# Altium schematic sheet Analog.SchDoc: Analog
size A4; Author: -; CompanyName: IOElectro; DrawnBy: Esmaeill M; Engineer: -; Organization: IOElectro; Address1: Bushehr,Iran; Address2: www.ioelectro.ir; DocumentNumber: 5; Revision: v0.1; SheetNumber: 5; SheetTotal: 6; ProjectNumber: 1013; Note: Analog module
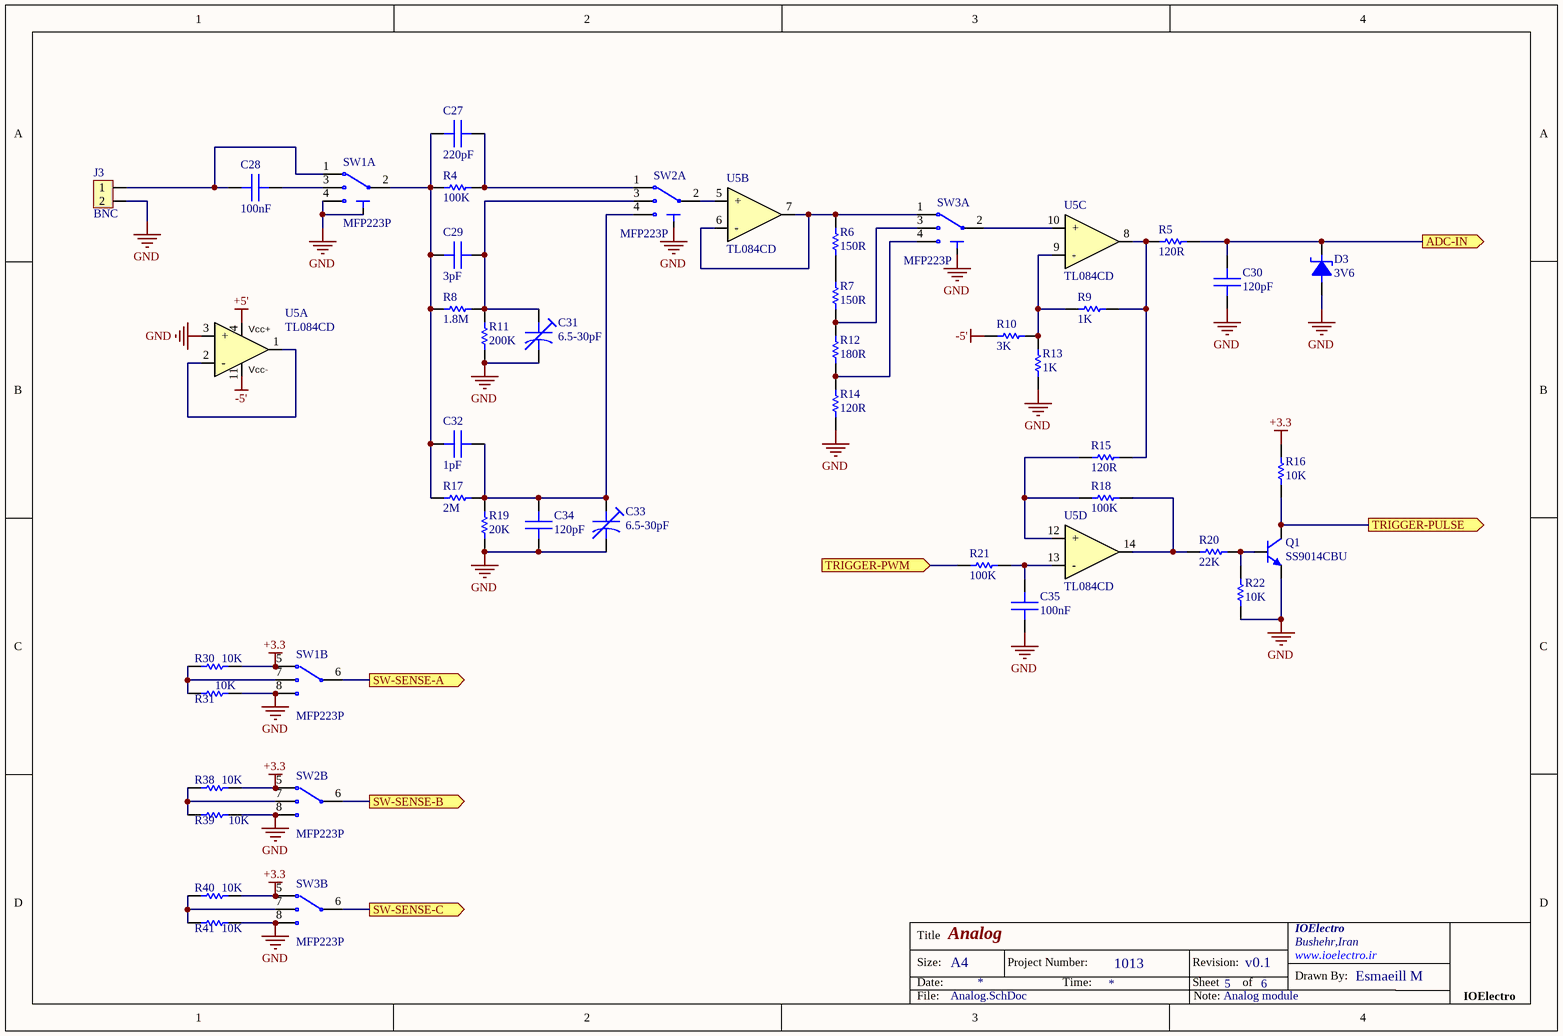
[diagram p0: Analog.SchDoc]

## Parts
C27  220pF  [C-BP-Ceramic-DIP]
C28  100nF  [C-BP-Ceramic-DIP]
C29  3pF  [C-BP-Ceramic-DIP]
C30  120pF  [C-BP-Ceramic-DIP]
C31  6.5-30pF  [C-TR-DIP_5mm]
C32  1pF  [C-BP-Ceramic-DIP]
C33  6.5-30pF  [C-TR-DIP_5mm]
C34  120pF  [C-BP-Ceramic-DIP]
C35  100nF  [C-BP-Ceramic-DIP]
D3  3V6  [SOD80]
J3  BNC  [PH-1X2-N3D]
Q1  SS9014CBU  [TO-92]
R4  100K  [R-1/4W-DIP-Blue]
R5  120R  [R-1/4W-DIP-Blue]
R6  150R  [R-1/4W-DIP-Blue]
R7  150R  [R-1/4W-DIP-Blue]
R8  1.8M  [R-1/4W-DIP-Blue]
R9  1K  [R-1/4W-DIP-Blue]
R10  3K  [R-1/4W-DIP-Blue]
R11  200K  [R-1/4W-DIP-Blue]
R12  180R  [R-1/4W-DIP-Blue]
R13  1K  [R-1/4W-DIP-Blue]
R14  120R  [R-1/4W-DIP-Blue]
R15  120R  [R-1/4W-DIP-Blue]
R16  10K  [R-0805]
R17  2M  [R-1/4W-DIP-Blue]
R18  100K  [R-1/4W-DIP-Blue]
R19  20K  [R-1/4W-DIP-Blue]
R20  22K  [R-0805]
R21  100K  [R-1/4W-DIP-Blue]
R22  10K  [R-0805]
R30  10K  [R-0805]
R31  10K  [R-0805]
R38  10K  [R-0805]
R39  10K  [R-0805]
R40  10K  [R-0805]
R41  10K  [R-0805]
SW1  MFP223P  [MFP223P]  (parts A,B of 2)
SW2  MFP223P  [MFP223P]  (parts A,B of 2)
SW3  MFP223P  [MFP223P]  (parts A,B of 2)
U5  TL084CD  [SO-14]  (parts A,B,C,D of 4)

## Ports
ADC-IN (out), SW-SENSE-A (out), SW-SENSE-B (out), SW-SENSE-C (out), TRIGGER-PULSE (out), TRIGGER-PWM (in)

## Nets
+3.3: R16.2 R30.1 R38.1 R40.1 SW1.5 SW2.5 SW3.5
+5': U5.4(Vcc+)
-5': R10.1 U5.11(Vcc-)
GND: C30.2 C31.K C33.K C34.2 C35.2 D3.A J3.2 Q1.1(E) R11.1 R13.2 R14.1 R19.1 R22.1 R31.1 R39.1 R41.1 SW1.0 SW1.4 SW1.8 SW2.0 SW2.8 SW3.0 SW3.8 U5.3(+)
ADC-IN: C30.1 D3.K R5.1 ; port ADC-IN
SW-SENSE-A: SW1.6 ; port SW-SENSE-A
SW-SENSE-B: SW2.6 ; port SW-SENSE-B
SW-SENSE-C: SW3.6 ; port SW-SENSE-C
TRIGGER-PULSE: Q1.3(C) R16.1 ; port TRIGGER-PULSE
TRIGGER-PWM: R21.2 ; port TRIGGER-PWM
NetC27_1: C27.1 R4.2 SW2.1
NetC27_2: C27.2 C29.2 C32.2 R4.1 R8.1 R17.1 SW1.2
NetC28_1: C28.1 SW1.3
NetC28_2: C28.2 J3.1 SW1.1
NetC29_1: C29.1 C31.A R8.2 R11.2 SW2.3
NetC32_1: C32.1 C33.A C34.1 R17.2 R19.2 SW2.4
NetC35_1: C35.1 R21.1 U5.13(-)
NetQ1_2: Q1.2(B) R20.1 R22.2
NetR5_2: R5.2 R9.1 R15.1 U5.8(O)
NetR6_1: R6.1 R7.2
NetR6_2: R6.2 SW3.1 U5.6(-) U5.7(O)
NetR7_1: R7.1 R12.2 SW3.3
NetR9_2: R9.2 R10.2 R13.1 U5.9(-)
NetR12_1: R12.1 R14.2 SW3.4
NetR15_2: R15.2 R18.2 U5.12(+)
NetR18_1: R18.1 R20.2 U5.14(O)
NetR30_2: R30.2 R31.2 SW1.7
NetR38_2: R38.2 R39.2 SW2.7
NetR40_2: R40.2 R41.2 SW3.7
NetSW2_2: SW2.2 U5.5(+)
NetSW3_2: SW3.2 U5.10(+)
NetU5_1: U5.1(O) U5.2(-)

## Notes on the sheet
- Title
- Size:
- Date:
- A4
- Project Number:
- Time:
- Revision:
- Sheet
- of
- Drawn By:
- IOElectro
- File:
- Note:

## Library data of the parts
C27-C30 C32 C34 C35 = CAP: Ceramic Disk Capacitor 50V
C31 C33 = GKG30015: Trimmer / Variable Capacitors 6.5-30pF 100V 85 DEG; Manufacturer: Sprague Goodman; Q Factor: 300; Supplier 1: Digi-Key; Manufacturer Part Number: GKG30015; RoHS: Yes; Category: Trimmer / Variable Capacitors; Mount: Through Hole; Min Operating Temperature: -25°C; Max Operating Temperature: 85°C; Package Quantity: 500; Voltage Rating: 100V; Packaging: Bulk; Termination: Snap in; Resistor Type: Ceramic; Voltage Rating (DC): 100V; Features: General Purpose; Series: SURFTRIM® GKG; Length: 6mm; Height: 0.2inch; Lead Pitch: 0.24inch; Height - Seated (Max): 0.197inch; RoHS Compliant: Yes; Lead Free: Lead Free; ComponentLink1URL: http://www.mouser.com/catalog/specsheets/659305J.pdf?src-supplier=Mouser; ComponentLink1Description: http://www.mouser.com/catalog/specsheets/659305J.pdf?src-supplier=Mouser; ComponentLink2URL: https://media.digikey.com/pdf/Data%20Sheets/Sprague-Goodman%20PDFs/Ceramic%20Dielectric%20Trimmer%20Caps.pdf?src-supplier=Digi-Key; ComponentLink2Description: https://media.digikey.com/pdf/Data%20Sheets/Sprague-Goodman%20PDFs/Ceramic%20Dielectric%20Trimmer%20Caps.pdf?src-supplier=Digi-Key; ComponentLink3URL: http://www.spraguegoodman.com/pdfs/305.pdf?src-supplier=Digi-Key; ComponentLink3Description: http://www.spraguegoodman.com/pdfs/305.pdf?src-supplier=Digi-Key; Supplier Part Number 1: SG30015-ND
D3 = DIODE-Z: SMD MiniMELF
J3 = PH-1X2: PIN HEADER 1x2 2.56mm
Q1 = SS9014CBU: Bipolar (BJT) Single Transistor, NPN, 45 V, 270 MHz, 450 mW, 100 mA, 200; Manufacturer: ON Semiconductor; Max Power Dissipation: 450mW; Frequency: 270MHz; Number of Elements: 1; Collector Emitter Voltage (VCEO): 45V; hFE Min: 60; Max Collector Current: 100mA; Collector Base Voltage (VCBO): 50V; Emitter Base Voltage (VEBO): 5V; Collector Emitter Saturation Voltage: 140mV; Collector-emitter Voltage-Max: 300mV; Supplier 1: Digi-Key; Manufacturer Part Number: SS9014CBU; Category: BJTs; Mount: Through Hole; Case/Package: TO-92; Number of Pins: 3; Weight: 0.179g; Min Operating Temperature: -55°C; Max Operating Temperature: 150°C; Packaging: Bulk; Package Quantity: 1000; Transition Frequency: 270MHz; Polarity: NPN; Power Dissipation: 450mW; Collector Emitter Breakdown Voltage: 45V; Element Configuration: Single; Gain Bandwidth Product: 270MHz; Max Frequency: 270MHz; Voltage Rating (DC): 45V; Current Rating: 100mA; Series: -; Length: 4.58mm; Width: 3.86mm; Height: 4.58mm; Radiation Hardening: No; REACH SVHC: No SVHC; Lead Free: Lead Free; RoHS Compliant: Yes; ComponentLink1URL: https://datasheet.ciiva.com/11207/ss9014-11207537.pdf?src-supplier=Avnet; ComponentLink1Description: https://datasheet.ciiva.com/11207/ss9014-11207537.pdf?src-supplier=Avnet; ComponentLink2URL: https://datasheet.ciiva.com/46415/1863528-46415612.pdf?src-supplier=Element14; ComponentLink2Description: https://datasheet.ciiva.com/46415/1863528-46415612.pdf?src-supplier=Element14; ComponentLink3URL: https://datasheet.ciiva.com/978/ss9014-978974.pdf?src-supplier=Digi-Key; ComponentLink3Description: https://datasheet.ciiva.com/978/ss9014-978974.pdf?src-supplier=Digi-Key; ComponentLink4URL: http://datasheet.octopart.com/SS9014CBU-Fairchild-datasheet-4532.pdf?src-supplier=Newark; ComponentLink4Description: http://datasheet.octopart.com/SS9014CBU-Fairchild-datasheet-4532.pdf?src-supplier=Newark; ComponentLink5URL: http://datasheet.octopart.com/SS9014CBU-ON-Semiconductor-datasheet-85608206.pdf?src-supplier=ON+Semiconductor; ComponentLink5Description: http://datasheet.octopart.com/SS9014CBU-ON-Semiconductor-datasheet-85608206.pdf?src-supplier=ON+Semiconductor; ComponentLink6URL: http://datasheet.octopart.com/SS9014CBU-ON-Semiconductor-datasheet-86698737.pdf?src-supplier=ON+Semiconductor; ComponentLink6Description: http://datasheet.octopart.com/SS9014CBU-ON-Semiconductor-datasheet-86698737.pdf?src-supplier=ON+Semiconductor; ComponentLink7URL: http://datasheet.octopart.com/SS9014CBU-ON-Semiconductor-datasheet-102168068.pdf?src-supplier=ON+Semiconductor; ComponentLink7Description: http://datasheet.octopart.com/SS9014CBU-ON-Semiconductor-datasheet-102168068.pdf?src-supplier=ON+Semiconductor; ComponentLink8URL: http://datasheet.octopart.com/SS9014CBU-ON-Semiconductor-datasheet-86693094.pdf?src-supplier=Element14; ComponentLink8Description: http://datasheet.octopart.com/SS9014CBU-ON-Semiconductor-datasheet-86693094.pdf?src-supplier=Element14; ComponentLink9URL: http://sigma.octopart.com/8329026/technical_drawing/Fairchild-Semiconductor-SS9014CBU.pdf?src-supplier=Fairchild+Semiconductor; ComponentLink9Description: http://sigma.octopart.com/8329026/technical_drawing/Fairchild-Semiconductor-SS9014CBU.pdf?src-supplier=Fairchild+Semiconductor; ComponentLink10URL: http://datasheet.octopart.com/SS9014CBU-Fairchild-Semiconductor-datasheet-67476720.pdf?src-supplier=Newark; ComponentLink10Description: http://datasheet.octopart.com/SS9014CBU-Fairchild-Semiconductor-datasheet-67476720.pdf?src-supplier=Newark; ComponentLink11URL: http://datasheet.octopart.com/SS9014CBU-Fairchild-Semiconductor-datasheet-68342036.pdf?src-supplier=Farnell; ComponentLink11Description: http://datasheet.octopart.com/SS9014CBU-Fairchild-Semiconductor-datasheet-68342036.pdf?src-supplier=Farnell; ComponentLink12URL: http://datasheet.octopart.com/SS9014CBU-Fairchild-Semiconductor-datasheet-68481733.pdf?src-supplier=Newark; ComponentLink12Description: http://datasheet.octopart.com/SS9014CBU-Fairchild-Semiconductor-datasheet-68481733.pdf?src-supplier=Newark; ComponentLink13URL: http://datasheet.octopart.com/SS9014CBU-Fairchild-Semiconductor-datasheet-68661175.pdf?src-supplier=Farnell; ComponentLink13Description: http://datasheet.octopart.com/SS9014CBU-Fairchild-Semiconductor-datasheet-68661175.pdf?src-supplier=Farnell; ComponentLink14URL: http://datasheet.octopart.com/SS9014CBU-Fairchild-Semiconductor-datasheet-78857804.pdf?src-supplier=Farnell; ComponentLink14Description: http://datasheet.octopart.com/SS9014CBU-Fairchild-Semiconductor-datasheet-78857804.pdf?src-supplier=Farnell; ComponentLink15URL: http://datasheet.octopart.com/SS9014CBU-Fairchild-Semiconductor-datasheet-78861914.pdf?src-supplier=Newark; ComponentLink15Description: http://datasheet.octopart.com/SS9014CBU-Fairchild-Semiconductor-datasheet-78861914.pdf?src-supplier=Newark; Supplier Part Number 1: SS9014CBU-ND
R4-R15 R17-R19 R21 = RES: Resistor DIP 1/4W 1%
R16 R20 R22 R30 R31 R38-R41 = RES: 0805
SW1-SW3 = MFP223P: Switch Slide ON ON ON Extended Top Slide 0.35A 30VDC 10000Cycle PC Pins Bracket Mount/Through Hole; Manufacturer: Knitter-Switch; Mechanical Life: 10000Cycles; Actuator Material: Polyoxymethylene; Max Voltage Rating (DC): 30V; Max Current Rating: 200mA; Supplier 1: Arrow Europe; Manufacturer Part Number: MFP223P; RoHS: Yes; Category: Uncategorized; Mount: Through Hole,Brackets; Contact Material: Copper Alloy; Contact Plating: Nickel,Silver; Housing Material: Resin; Min Operating Temperature: -20°C; Max Operating Temperature: 85°C; Termination: PC Pins; Length: 16mm; Depth: 6.5mm; Radiation Hardening: No; Lead Free: Lead Free; RoHS Compliant: Yes; ComponentLink1URL: https://datasheet.ciiva.com/26847/getdatasheetpartid-740636-26847254.pdf?src-supplier=Verical; ComponentLink1Description: https://datasheet.ciiva.com/26847/getdatasheetpartid-740636-26847254.pdf?src-supplier=Verical; Supplier Part Number 1: MFP223P
U5 = TL084CD: IC OPAMP JFET 4MHZ 14SO; Manufacturer: STMicroelectronics; Operating Supply Voltage: 18V; Max Supply Voltage: 36V; Dual Supply Voltage: 15V; Voltage Gain: 106.02dB; Slew Rate: 16V/µs; Number of Channels: 4; Common Mode Rejection Ratio: 70dB; Min Dual Supply Voltage: 3V; Output Current: 40mA; Nominal Supply Current: 2.5mA; Min Input Voltage: -12V; Input Bias Current: 200pA; Input Offset Voltage (Vos): 10mV; Operating Supply Current: 1.4mA; Power Dissipation: 680mW; Rise Time: 50ns; Amplifier Type: GENERAL PURPOSE; Supplier 1: Digi-Key; Manufacturer Part Number: TL084CD; RoHS: Yes; Category: Amplifiers - Audio; Stock 1: 3951; Pricing 1: 1=0/56000, 10=0/47700, 25=0/44520, 100=0/35620, 250=0/33072, 500=0/27984, 1000=0/21624, 2500=0/21000 (USD); Mount: Surface Mount; Case/Package: SOIC; Number of Pins: 14; Weight: 0.01lb; Min Operating Temperature: 0°C; Max Operating Temperature: 70°C; Package Quantity: 50; Packaging: Rail/Tube; Unity Gain Bandwidth Product: 4MHz; Max Dual Supply Voltage: 18V; Bandwidth: 4MHz; Max Input Voltage: 15V; Number of Circuits: 4; Gain Bandwidth Product: 4MHz; Output Current per Channel: 40mA; Number of Elements: 4; Number of Amplifiers: 4; Supply Current: 2.5mA; Technology: BIFET; Input Offset Voltage-Max: 10mV; Slew Rate-Nom: 16V/µs; Length: 8.75mm; Width: 4mm; Height: 1.65mm; Radiation Hardening: No; REACH SVHC: No SVHC; Lead Free: Lead Free; RoHS Compliant: Yes; ComponentLink1URL: https://datasheet.ciiva.com/15129/getdatasheetpartid-40720-15129705.pdf?src-supplier=Verical; ComponentLink1Description: https://datasheet.ciiva.com/15129/getdatasheetpartid-40720-15129705.pdf?src-supplier=Verical; ComponentLink2URL: https://datasheet.ciiva.com/29306/155629-da-01-en-op-verst-tl084cd-stm-29306876.pdf?src-supplier=Conrad; ComponentLink2Description: https://datasheet.ciiva.com/29306/155629-da-01-en-op-verst-tl084cd-stm-29306876.pdf?src-supplier=Conrad; ComponentLink3URL: https://datasheet.ciiva.com/1796/cd00000493-1796695.pdf?src-supplier=Digi-Key; ComponentLink3Description: https://datasheet.ciiva.com/1796/cd00000493-1796695.pdf?src-supplier=Digi-Key; ComponentLink4URL: https://datasheet.ciiva.com/16385/cd00000493-16385768.pdf?src-supplier=Future+Electronics; ComponentLink4Description: https://datasheet.ciiva.com/16385/cd00000493-16385768.pdf?src-supplier=Future+Electronics; Supplier Part Number 1: 497-TL084CD-ND